# Altium schematic sheet MCU_Power_Radio.SchDoc
size B
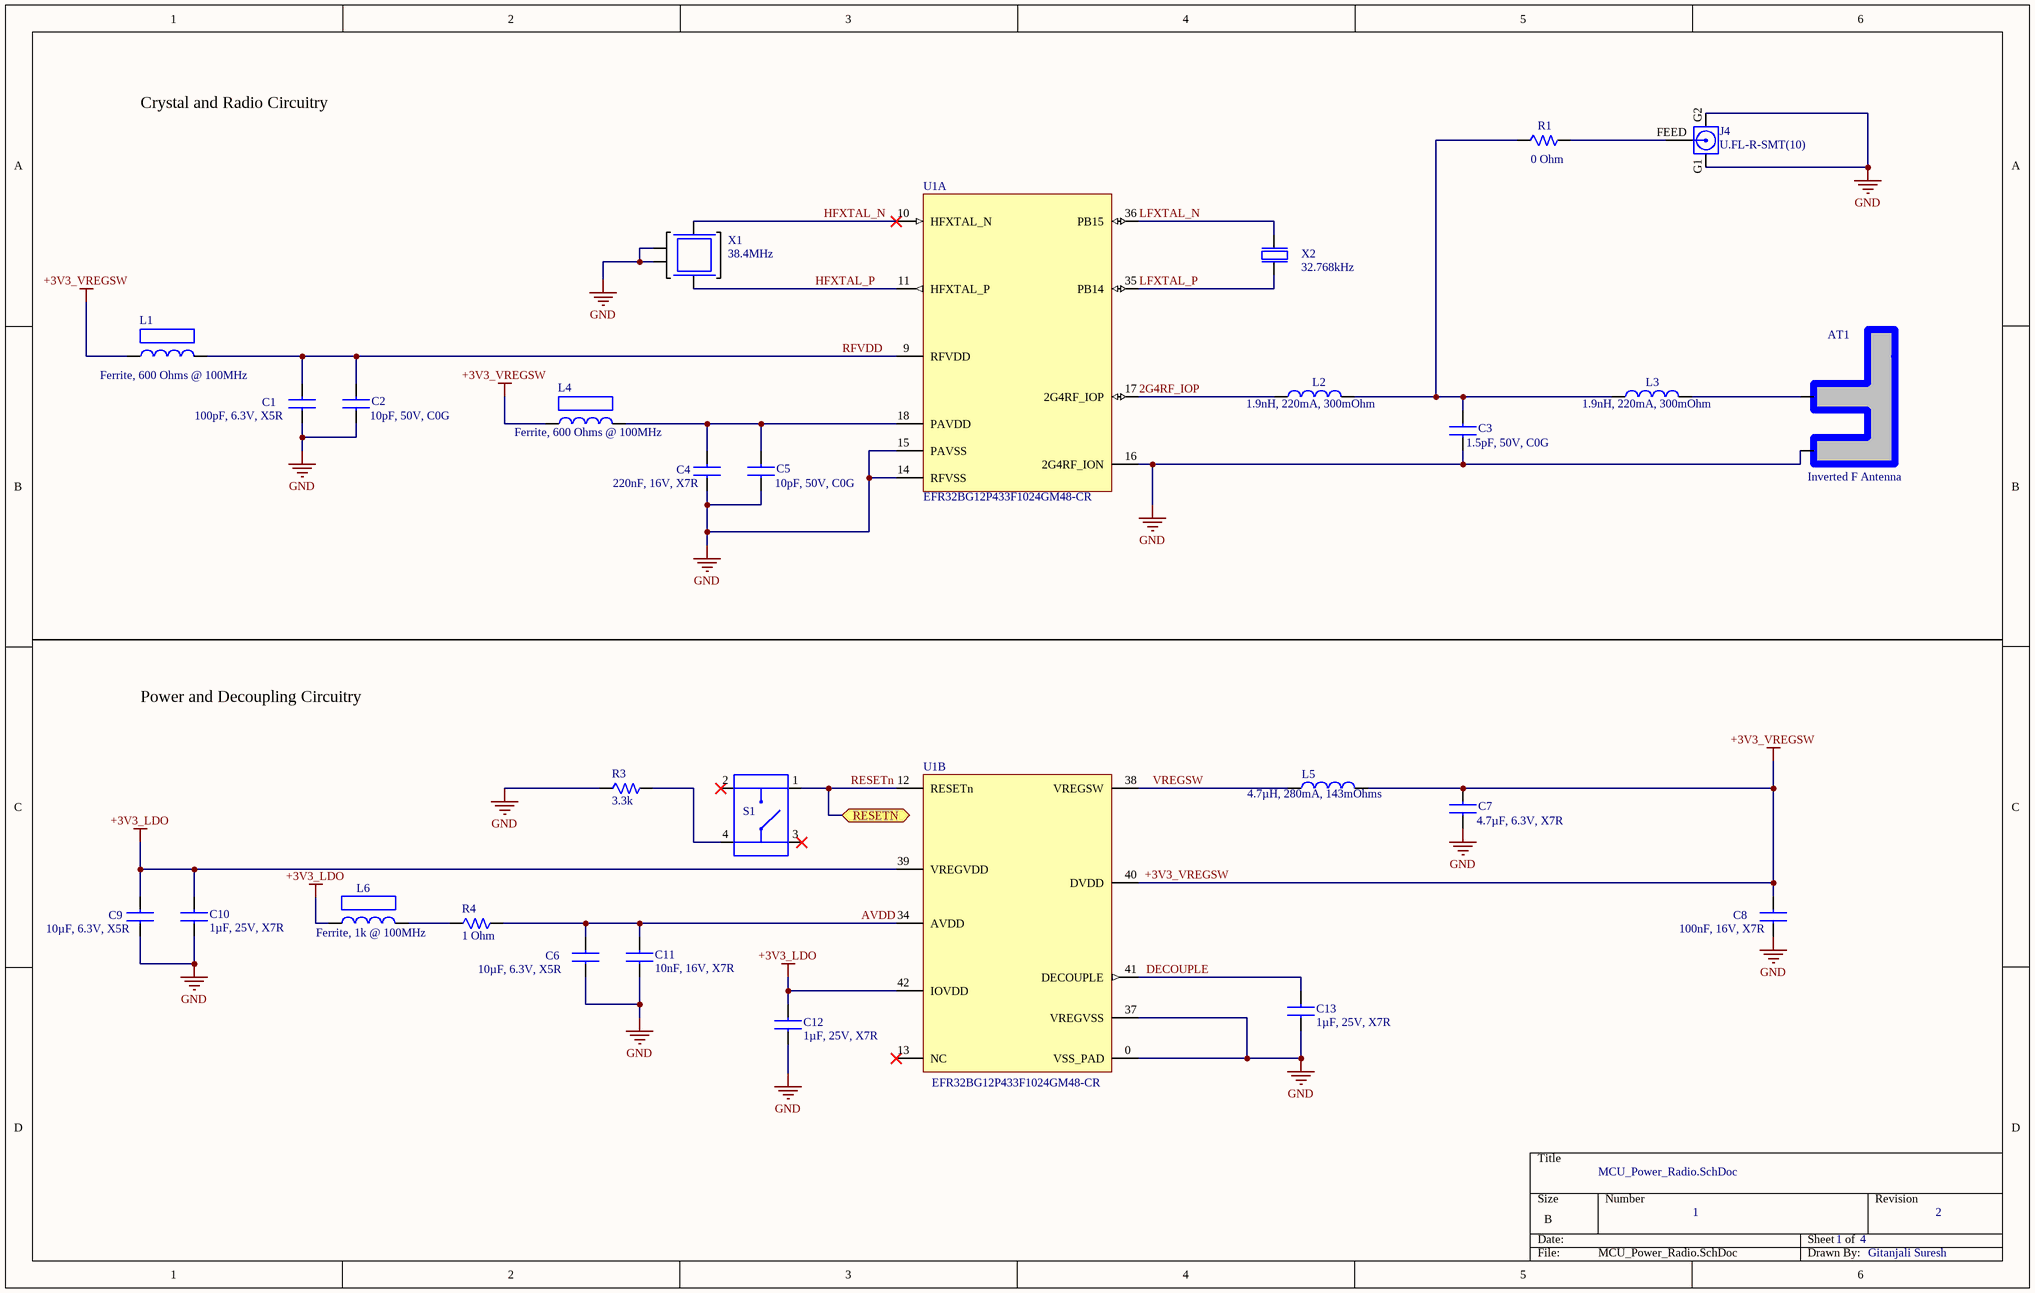
[diagram p0: MCU_Power_Radio.SchDoc]

## Parts
AT1  Inverted F Antenna  [F-Antenna]  (net tie, no BOM)
C1  100pF, 6.3V, X5R  [CAP_X7R_100PF]
C2  10pF, 50V, C0G  [CAP_0805_10PF]
C3  1.5pF, 50V, C0G  [CAP_0402_1.5pF]
C4  220nF, 16V, X7R  [CAP_X7R_100PF]
C5  10pF, 50V, C0G  [CAP_0805_10PF]
C6  10µF, 6.3V, X5R  [CAP_X5R_10UF]
C7  4.7µF, 6.3V, X7R  [CAP_X7R_4.7uF]
C8  100nF, 16V, X7R  [CAP_X7R_100NF]
C9  10µF, 6.3V, X5R  [CAP_X5R_10UF]
C10  1µF, 25V, X7R  [CAP_X7R_100PF]
C11  10nF, 16V, X7R  [CAP_X7R_100PF]
C12  1µF, 25V, X7R  [CAP_X7R_100PF]
C13  1µF, 25V, X7R  [CAP_X7R_100PF]
J4  U.FL-R-SMT(10)  [U.FL_connector]
L1  Ferrite, 600 Ohms @ 100MHz  [Ferrite_Bead_0603]
L2  1.9nH, 220mA, 300mOhm  [INDC1005X04N_1.9NH]
L3  1.9nH, 220mA, 300mOhm  [INDC1005X04N_1.9NH]
L4  Ferrite, 600 Ohms @ 100MHz  [Ferrite_Bead_0603]
L5  4.7µH, 280mA, 143mOhms  [IND_2228x1]
L6  Ferrite, 1k @ 100MHz  [Ferrite_Bead_1801x1]
R1  0 Ohm  [RES_0_0603]
R3  3.3k  [RES_0603_3.3k]
R4  1 Ohm  [RES_0603_10k]
S1  TACTILE SWITCH  [SW_PTS645SK50SMTR92LFS]  (value not drawn)
U1  EFR32BG12P433F1024GM48-CR  [QFN50P700X700X90_HS-49N]  (parts A,B of 3)
X1  38.4MHz  [OSCSC220P320X250X70-4N]
X2  32.768kHz  [XTAL320X150X90]

## Ports
RESETN (bidir)

## Nets
+3V3_LDO: C9.1 C10.2 C12.2 L6.2 U1.39(VREGVDD) U1.42(IOVDD)
+3V3_VREGSW: C7.1 C8.2 L1.1 L4.1 L5.2 U1.40(DVDD)
GND: AT1.1(GND) C1.1 C2.2 C3.2 C4.1 C5.2 C6.1 C7.2 C8.1 C9.2 C10.1 C11.1 C12.1 C13.1 J4.G1(GND1) J4.G2(GND2) R3.1 U1.0(VSS_PAD) U1.14(RFVSS) U1.15(PAVSS) U1.16(2G4RF_ION) U1.37(VREGVSS) X1.2 X1.4
2G4RF_IOP: L2.1 U1.17(2G4RF_IOP)
AVDD: C6.2 C11.2 R4.2 U1.34(AVDD)
DECOUPLE: C13.2 U1.41(DECOUPLE)
HFXTAL_N: U1.10(HFXTAL_N) X1.3
HFXTAL_P: U1.11(HFXTAL_P) X1.1
LFXTAL_N: U1.36(PB15) X2.1
LFXTAL_P: U1.35(PB14) X2.2
RESETn: S1.1 U1.12(RESETn) ; port RESETN
RFVDD: C1.2 C2.1 L1.2 U1.9(RFVDD)
VREGSW: L5.1 U1.38(VREGSW)
NetAT1_2: AT1.2(FEED) L3.2
NetC3_1: C3.1 L2.2 L3.1 R1.1
NetC4_2: C4.2 C5.1 L4.2 U1.18(PAVDD)
NetJ4_FEED: J4.FEED R1.2
NetL6_1: L6.1 R4.1
NetR3_2: R3.2 S1.4

Not connected (* = marked no-connect by the designer): S1 2* 3*; U1 13(NC)*

## Notes on the sheet
- Crystal and Radio Circuitry
- Power and Decoupling Circuitry
- 1
- 4
- 2
- Gitanjali Suresh

## Library data of the parts
AT1 = F_ANTENNA
C1 = 885012206028: 100 pF, 16 V, 0603 [1608 Metrické], ± 10%, X7R; Manufacturer: Wurth Electronics; Voltage Rating: 16V; Supplier 1: Digi-Key; Manufacturer Part Number: 885012206028; RoHS: Yes; Category: Ceramic Capacitors; Stock 1: 1513; Pricing 1: 1=0.10000, 10=0.02100, 100=0.01920, 500=0.01698 (USD); Mount: Surface Mount; Case/Package: 0603; Case Code (Imperial): 0603; Case Code (Metric): 1608; Min Operating Temperature: -55°C; Max Operating Temperature: 125°C; Tolerance: 10%; Packaging: Tape and Reel; Capacitance: 100pF; Length: 0.063inch; Width: 0.031inch; Thickness: 0.034inch; ComponentLink1URL: http://www.farnell.com/datasheets/2546812.pdf?src-supplier=Farnell; ComponentLink1Description: http://www.farnell.com/datasheets/2546812.pdf?src-supplier=Farnell; ComponentLink2URL: http://katalog.we-online.de/pbs/datasheet/885012206028.pdf?src-supplier=Digi-Key; ComponentLink2Description: http://katalog.we-online.de/pbs/datasheet/885012206028.pdf?src-supplier=Digi-Key; ComponentLink3URL: https://katalog.we-online.de/pbs/datasheet/885012206028.pdf?src-supplier=Digi-Key; ComponentLink3Description: https://katalog.we-online.de/pbs/datasheet/885012206028.pdf?src-supplier=Digi-Key; Supplier Part Number 1: 732-7947-1-ND
C2 C5 = VJ0805A100JXACW1BC: CERAMIC CAP 10PF 50V, C0G, 5%, 0805; Manufacturer: Vishay; Dielectric Material: Tantalum; Temperature Coefficient: 0ppm/°C; Supplier 1: Digi-Key; Manufacturer Part Number: VJ0805A100JXACW1BC; RoHS: Yes; Category: Ceramic Capacitors; Stock 1: 4065; Pricing 1: 1=0.20000, 10=0.14000, 50=0.07940, 100=0.06580, 500=0.04614, 1000=0.03819 (USD); Mount: Surface Mount; Case/Package: 0805; Number of Pins: 2; Case Code (Metric): 2012; Case Code (Imperial): 0805; Min Operating Temperature: -55°C; Max Operating Temperature: 125°C; Voltage Rating (DC): 50V; Tolerance: 5%; Packaging: Tape and Reel; Package Quantity: 4000; Capacitance: 10pF; Voltage Rating: 50V; Dielectric: C0G; Termination: SMD/SMT; Length: 2mm; Height: 1.45mm; Width: 0.049inch; Thickness: 0.03inch; Depth: 1.25mm; REACH SVHC: Unknown; Lead Free: Lead Free; ComponentLink1URL: https://datasheet.ciiva.com/8063/1760306-8063331.pdf?src-supplier=Element14; ComponentLink1Description: https://datasheet.ciiva.com/8063/1760306-8063331.pdf?src-supplier=Element14; ComponentLink2URL: https://datasheet.ciiva.com/176/vjw1bcbascomseries-176727.pdf?src-supplier=Digi-Key; ComponentLink2Description: https://datasheet.ciiva.com/176/vjw1bcbascomseries-176727.pdf?src-supplier=Digi-Key; ComponentLink3URL: https://datasheet.ciiva.com/11486/vjw1bcbascomseries-11486214.pdf?src-supplier=Avnet; ComponentLink3Description: https://datasheet.ciiva.com/11486/vjw1bcbascomseries-11486214.pdf?src-supplier=Avnet; ComponentLink4URL: https://datasheet.ciiva.com/16201/vjw1bcbascomseries-16201004.pdf?src-supplier=Future+Electronics; ComponentLink4Description: https://datasheet.ciiva.com/16201/vjw1bcbascomseries-16201004.pdf?src-supplier=Future+Electronics; Supplier Part Number 1: 720-1625-1-ND
C3 = GJM1555C1H1R5WB01D: Cap Ceramic 1.5pF 50V C0G 0.05pF SMD 0402 125C Paper T/R; Manufacturer: Murata; Supplier 1: Digi-Key; Manufacturer Part Number: GJM1555C1H1R5WB01D; RoHS: Yes; Category: Ceramic Capacitors; Stock 1: 83250; Pricing 1: 1=0.24000, 10=0.16200, 50=0.10800, 100=0.09180, 500=0.06480, 1000=0.05670, 2500=0.05400, 5000=0.04995 (USD); Mount: Surface Mount; Case/Package: 0402; Case Code (Imperial): 0402; Case Code (Metric): 1005; Min Operating Temperature: -55°C; Max Operating Temperature: 125°C; Packaging: Tape and Reel; Capacitance: 1.5pF; Voltage Rating: 50V; Voltage Rating (DC): 50V; Package Quantity: 10000; Dielectric: C0G; Termination: SMD/SMT; Length: 1mm; Height: 0.5mm; Width: 0.02inch; Thickness: 0.022inch; Depth: 0.5mm; Radiation Hardening: No; Lead Free: Lead Free; ComponentLink1URL: https://datasheet.ciiva.com/18183/getdatasheetpartid-312921-18183825.pdf?src-supplier=Verical; ComponentLink1Description: https://datasheet.ciiva.com/18183/getdatasheetpartid-312921-18183825.pdf?src-supplier=Verical; Supplier Part Number 1: 490-11199-1-ND
C4 = 885012206048: 220nF/0.22UF, 16V, X7R, 10%, 0603, CERAMIC CAPACITOR ; Product Range:CC Series; Capacitance:0.22 F; Capacitance Tolerance: 10%; Dielectric Characteristic:X7R; Voltage Rating:16V; Ceramic Capacitor Case:0603 ; Packaging:Cut Tape;RoHS Compliant: Yes; Manufacturer: Yageo; Manufacturer Part Number: CC0805KRX7R7BB224; Insulation Resistance: 100GR; RoHS: Yes; Category: Ceramic Capacitors; Stock 1: 3851; Pricing 1: 1=0.19000, 10=0.13300, 50=0.07560, 100=0.06260, 500=0.04392, 1000=0.03636 (USD); Mount: Surface Mount; Case/Package: 0805; Number of Pins: 2; Dielectric Material: Ceramic; Case Code (Imperial): 0805; Case Code (Metric): 2012; Material: Ceramic; Min Operating Temperature: -55°C; Max Operating Temperature: 125°C; Capacitance: 220nF; Tolerance: 10%; Dielectric: X7R; Packaging: Tape and Reel; Voltage: 16V; Voltage Rating: 16V; Termination: SMD/SMT; Length: 2mm; Height: 0.85mm; Depth: 1.25mm; Width: 0.049inch; Thickness: 0.037inch; Radiation Hardening: No; REACH SVHC: Unknown; Lead Free: Lead Free; Halogen Free: Halogen Free; ComponentLink1URL: https://datasheet.ciiva.com/8034/1489800-8034021.pdf?src-supplier=Element14; ComponentLink1Description: https://datasheet.ciiva.com/8034/1489800-8034021.pdf?src-supplier=Element14; ComponentLink2URL: https://datasheet.ciiva.com/8034/1489800-8034022.pdf?src-supplier=Element14; ComponentLink2Description: https://datasheet.ciiva.com/8034/1489800-8034022.pdf?src-supplier=Element14; ComponentLink3URL: https://datasheet.ciiva.com/15189/getdatasheetpartid-315919-15189222.pdf?src-supplier=Verical; ComponentLink3Description: https://datasheet.ciiva.com/15189/getdatasheetpartid-315919-15189222.pdf?src-supplier=Verical; ComponentLink4URL: https://datasheet.ciiva.com/16624/upy-gphc-x7r-6-3v-to-50v-8-16624663.pdf?src-supplier=Avnet+Europe; ComponentLink4Description: https://datasheet.ciiva.com/16624/upy-gphc-x7r-6-3v-to-50v-8-16624663.pdf?src-supplier=Avnet+Europe; ComponentLink5URL: https://datasheet.ciiva.com/7978/1489800-7978206.pdf?src-supplier=Element14; ComponentLink5Description: https://datasheet.ciiva.com/7978/1489800-7978206.pdf?src-supplier=Element14; Supplier 1: Digi-Key; Supplier Part Number 1: 732-7967-1-ND
C6 C9 = 885012107004: CAP CER 10UF 6.3V X5R 0805; Manufacturer: Wurth Electronics; Tolerance: 20%; Supplier 1: Digi-Key; Manufacturer Part Number: 885012107004; RoHS: Yes; Category: Ceramic Capacitors; Stock 1: 10674; Pricing 1: 1=0.19000, 10=0.17100, 100=0.15310, 500=0.13542, 1000=0.12500 (USD); Mount: Surface Mount; Case/Package: 0805; Case Code (Metric): 2012; Case Code (Imperial): 0805; Min Operating Temperature: -55°C; Max Operating Temperature: 85°C; Packaging: Tape and Reel; Capacitance: 10uF; Voltage Rating: 6.3V; Length: 0.079inch; Width: 0.049inch; Thickness: 0.053inch; ComponentLink1URL: https://katalog.we-online.de/pbs/datasheet/885012107004.pdf?src-supplier=Digi-Key; ComponentLink1Description: https://katalog.we-online.de/pbs/datasheet/885012107004.pdf?src-supplier=Digi-Key; Supplier Part Number 1: 732-7615-1-ND
C7 = CL10B475KQ8NQNC: 4.7uF, 6.3 V, 0603 [1608 Metric], 10%, X7R, CL Series Ceramic Capacitor,; Manufacturer: Samsung; Supplier 1: Digi-Key; Manufacturer Part Number: CL10B475KQ8NQNC; RoHS: Yes; Category: Ceramic Capacitors; Stock 1: 1537367; Pricing 1: 1=0.17000, 10=0.11800, 50=0.06720, 100=0.05560, 500=0.03898, 1000=0.03227 (USD); Mount: Surface Mount; Case/Package: 0603; Case Code (Metric): 1608; Case Code (Imperial): 0603; Contact Plating: Tin; Min Operating Temperature: -55°C; Max Operating Temperature: 125°C; Capacitance: 4.7uF; Tolerance: 10%; Dielectric: X7R; Package Quantity: 1; Packaging: Tape and Reel; Voltage Rating: 6.3V; Termination: Wraparound; Length: 1.6mm; Height: 0.8mm; Width: 0.031inch; Thickness: 0.035inch; Depth: 0.8mm; Lead Free: Lead Free; ComponentLink1URL: https://datasheet.ciiva.com/25733/cl10b475kq8nqnc-25733762.pdf?src-supplier=Digi-Key; ComponentLink1Description: https://datasheet.ciiva.com/25733/cl10b475kq8nqnc-25733762.pdf?src-supplier=Digi-Key; Supplier Part Number 1: 1276-2087-1-ND
C8 = C0603C104M4RACTU: CAP 100NF 16V 0603; Manufacturer: Murata; Manufacturer Part Number: LLL215R71C104MA11L; Tolerance: 20%; RoHS: Yes; Category: Ceramic Capacitors; Stock 1: 4067; Pricing 1: 1=0.35000, 10=0.24500, 50=0.17160, 100=0.14700, 500=0.11026, 1000=0.09310 (USD); Mount: Surface Mount; Case/Package: 0508; Case Code (Imperial): 0508; Case Code (Metric): 1220; Min Operating Temperature: -55°C; Max Operating Temperature: 125°C; Dielectric: X7R; Capacitance: 100nF; Voltage Rating (DC): 16V; Packaging: Tape and Reel; Voltage Rating: 16V; Package Quantity: 1; Termination: SMD/SMT; Voltage: 16V; Length: 1.25mm; Height: 0.5mm; Depth: 2mm; Width: 2mm; Thickness: 0.02inch; Radiation Hardening: No; Lead Free: Lead Free; ComponentLink1URL: https://datasheet.ciiva.com/17455/product-17455569.pdf?src-supplier=Avnet+Europe; ComponentLink1Description: https://datasheet.ciiva.com/17455/product-17455569.pdf?src-supplier=Avnet+Europe; ComponentLink2URL: https://datasheet.ciiva.com/11786/0900766b807a1cab-11786990.pdf?src-supplier=RSComponents; ComponentLink2Description: https://datasheet.ciiva.com/11786/0900766b807a1cab-11786990.pdf?src-supplier=RSComponents; ComponentLink3URL: https://datasheet.ciiva.com/139/partnumbering-e-01-139020.pdf?src-supplier=Digi-Key; ComponentLink3Description: https://datasheet.ciiva.com/139/partnumbering-e-01-139020.pdf?src-supplier=Digi-Key; ComponentLink4URL: https://datasheet.ciiva.com/139/partnumbering-e-01-139021.pdf?src-supplier=Digi-Key; ComponentLink4Description: https://datasheet.ciiva.com/139/partnumbering-e-01-139021.pdf?src-supplier=Digi-Key; ComponentLink5URL: https://datasheet.ciiva.com/139/partnumbering-e-01-139022.pdf?src-supplier=Digi-Key; ComponentLink5Description: https://datasheet.ciiva.com/139/partnumbering-e-01-139022.pdf?src-supplier=Digi-Key; Supplier 1: Digi-Key; Supplier Part Number 1: 399-1099-1-ND
C10 C12 C13 = 885012206076: CAP CER 1UF 25V X7R 0603; Manufacturer: Yageo; Manufacturer Part Number: CC1206MKX7R8BB105; Tolerance: 20%; RoHS: Yes; Category: Ceramic Capacitors; Stock 1: 18295; Pricing 1: 1=0.26000, 10=0.17700, 50=0.10640, 100=0.08980, 500=0.06146, 1000=0.05437 (USD); Mount: Surface Mount; Case/Package: 1206; Min Operating Temperature: -55°C; Max Operating Temperature: 125°C; Packaging: Tape and Reel; Capacitance: 1uF; Dielectric: X7R; Voltage Rating: 25V; Voltage Rating (DC): 25V; Length: 0.126inch; Width: 0.063inch; Thickness: 0.049inch; Depth: 1.6mm; Lead Free: Lead Free; Halogen Free: Halogen Free; ComponentLink1URL: https://datasheet.ciiva.com/13207/upy-gphc-x7r-6-3v-to-50v-8-12304-13207429.pdf?src-supplier=Mouser; ComponentLink1Description: https://datasheet.ciiva.com/13207/upy-gphc-x7r-6-3v-to-50v-8-12304-13207429.pdf?src-supplier=Mouser; Supplier 1: Digi-Key; Supplier Part Number 1: 732-7994-1-ND
C11 = 885012206040: CAP CER 10nF 16V X7R 0603; Manufacturer: Yageo; Manufacturer Part Number: CC0402MRX7R7BB103; Tolerance: 20%; RoHS: Yes; Category: Ceramic Capacitors; Stock 1: 33657; Pricing 1: 1=0.10000, 10=0.01800, 50=0.00960, 100=0.00780, 500=0.00558, 1000=0.00439, 2500=0.00399, 5000=0.00367 (USD); Mount: Surface Mount; Case/Package: 0402; Number of Pins: 2; Weight: 2.3E-05oz; Case Code (Metric): 1005; Case Code (Imperial): 0402; Min Operating Temperature: -55°C; Max Operating Temperature: 125°C; Packaging: Tape and Reel; Voltage Rating (DC): 16V; Capacitance: 10nF; Voltage Rating: 16V; Dielectric: X7R; Termination: SMD/SMT; Resistor Type: Ceramic; Length: 0.039inch; Width: 0.02inch; Thickness: 0.022inch; Depth: 0.5mm; REACH SVHC: No SVHC; Lead Free: Lead Free; Halogen Free: Halogen Free; ComponentLink1URL: https://datasheet.ciiva.com/13264/upy-gphc-x7r-6-3v-to-50v-8-12304-13264234.pdf?src-supplier=Mouser; ComponentLink1Description: https://datasheet.ciiva.com/13264/upy-gphc-x7r-6-3v-to-50v-8-12304-13264234.pdf?src-supplier=Mouser; Supplier 1: Digi-Key; Supplier Part Number 1: 732-7959-1-ND
J4 = U.FL connector U.FL-R-SMT(10): CONN UMC JACK STR 50 OHM SMD; Manufacturer: Hirose Electric Co Ltd; Connector Style: U.FL; Connector Type: Jack, Male Pin; Contact Termination: Solder; Impedance: 50 Ohm; Frequency - Max: 6GHz; Body Material: Phosphor Bronze; Body Finish: Silver; Center Contact Plating: Gold; Dielectric Material: Liquid Crystal Polymer (LCP); Gender: Plug; Brand: Hirose Connector; Maximum Frequency: 6 GHz; Supplier 1: Digi-Key; RoHS: RoHS Compliant; Category: Connectors, Interconnects; Stock 1: 132773; Pricing 1: 1=1.33, 10=1.173, 25=1.104, 50=1.058, 100=1.012, 250=0.92004, 500=0.82804, 1000=0.7216 (USD); Packaging: Cut Tape (CT); Shield Termination: Solder; Mounting Type: Surface Mount; Cable Group: -; Fastening Type: Snap-On; Features: -; Housing Color: Silver; Ingress Protection: -; Center Contact Material: Phosphor Bronze; Voltage Rating: -; Operating Temperature: -40°C ~ 90°C; ComponentLink1URL: http://media.digikey.com/pdf/Data%20Sheets/Hirose%20PDFs/UFL%20Series.pdf; ComponentLink1Description: http://media.digikey.com/pdf/Data%20Sheets/Hirose%20PDFs/UFL%20Series.pdf; Supplier 2: Mouser; Stock 2: 89108; Pricing 2: 1=1.75, 10=1.40, 100=1.34, 250=1.22, 500=1.12, 1000=0.974, 2500=0.882, 5000=0.852, 10000=0.792 (AUD); Contact Plating: Gold; Operating Temperature Range: - 40 C to + 90 C; Orientation: Vertical; Product: Connectors; Series: U.FL; Termination Style: Solder; Contact Material: Brass; Product Category: Coaxial Connectors; Standard Pack Qty: 2500; Tradename: U.FL; RoHS - Mouser: Y; Minimum Order Quantity: 1; Reeling: True; ComponentLink2URL: http://www.hirose.co.jp/cataloge_hp/ed_UFL_20141014.pdf; ComponentLink2Description: http://www.hirose.co.jp/cataloge_hp/ed_UFL_20141014.pdf; Supplier Part Number 1: H9161CT-ND; Supplier Part Number 2: 798-U.FL-R-SMT10; Manufacturer Part Number: U.FL-R-SMT(10)
L1 L4 = BLM18AG601SN1D: BLM18AG601SN1D - Ferrite Bead, 0603 / 1608, 600 ohm, 500 mA, Série BLM18A, 0.38 ohm, ± 25%; Manufacturer: Murata; Material: Steel,Ferrite; Impedance: 600R; Current Rating: 500mA; DC Resistance (DCR): 380mR; Shielding: Unshielded; Number of Circuits: 1; Supplier 1: Digi-Key; Manufacturer Part Number: BLM18AG601SN1D; RoHS: Yes; Category: Inductors; Stock 1: 294956; Pricing 1: 1=0.10000, 10=0.07200, 25=0.06560, 50=0.05900, 100=0.04320, 250=0.03144, 500=0.02882, 1000=0.02489 (USD); Case/Package: 0603; Number of Pins: 2; Weight: 7.1E-05oz; Core Material: Ferrite; Case Code (Metric): 1608; Case Code (Imperial): 0603; Min Operating Temperature: -55°C; Max Operating Temperature: 125°C; Tolerance: 25%; Package Quantity: 1; Packaging: Tape and Reel; Termination: SMD/SMT; Max DC Current: 500mA; Max Current Rating: 500mA; Number of Lines: 1; Test Frequency: 100MHz; DC Current: 500mA; Frequency: 100MHz; Length: 1.6mm; Height: 0.8mm; Width: 0.8mm; Depth: 0.8mm; Radiation Hardening: No; REACH SVHC: No SVHC; Military Standard: Not; Lead Free: Lead Free; ComponentLink1URL: https://datasheet.ciiva.com/19460/1844766-19460213.pdf?src-supplier=Jameco; ComponentLink1Description: https://datasheet.ciiva.com/19460/1844766-19460213.pdf?src-supplier=Jameco; ComponentLink2URL: https://datasheet.ciiva.com/29347/442309-da-01-en-chip-drossel-0603-600r-500ma-1-6x0-8mm-29347900.pdf?src-supplier=Conrad; ComponentLink2Description: https://datasheet.ciiva.com/29347/442309-da-01-en-chip-drossel-0603-600r-500ma-1-6x0-8mm-29347900.pdf?src-supplier=Conrad; ComponentLink3URL: https://datasheet.ciiva.com/41449/001172228-da-01-en-drossel-0603-600r-1-6x0-8mm-4000st-41449517.pdf?src-supplier=Conrad; ComponentLink3Description: https://datasheet.ciiva.com/41449/001172228-da-01-en-drossel-0603-600r-1-6x0-8mm-4000st-41449517.pdf?src-supplier=Conrad; ComponentLink4URL: https://datasheet.ciiva.com/1012/l0110s0100blm18a-1012017.pdf?src-supplier=Digi-Key; ComponentLink4Description: https://datasheet.ciiva.com/1012/l0110s0100blm18a-1012017.pdf?src-supplier=Digi-Key; ComponentLink5URL: https://datasheet.ciiva.com/1012/l0110s0100blm18a-1012018.pdf?src-supplier=Digi-Key; ComponentLink5Description: https://datasheet.ciiva.com/1012/l0110s0100blm18a-1012018.pdf?src-supplier=Digi-Key; ComponentLink6URL: https://datasheet.ciiva.com/1012/l0110s0100blm18a-1012019.pdf?src-supplier=Digi-Key; ComponentLink6Description: https://datasheet.ciiva.com/1012/l0110s0100blm18a-1012019.pdf?src-supplier=Digi-Key; ComponentLink7URL: https://datasheet.ciiva.com/1466/1756147-1466933.pdf?src-supplier=Element14; ComponentLink7Description: https://datasheet.ciiva.com/1466/1756147-1466933.pdf?src-supplier=Element14; ComponentLink8URL: https://datasheet.ciiva.com/1466/1756147-1466934.pdf?src-supplier=Element14; ComponentLink8Description: https://datasheet.ciiva.com/1466/1756147-1466934.pdf?src-supplier=Element14; ComponentLink9URL: https://datasheet.ciiva.com/16210/l0110s0100blm18a-16210006.pdf?src-supplier=Future+Electronics; ComponentLink9Description: https://datasheet.ciiva.com/16210/l0110s0100blm18a-16210006.pdf?src-supplier=Future+Electronics; ComponentLink10URL: https://datasheet.ciiva.com/3081/l0110s0100blm18a-3081613.pdf?src-supplier=Avnet; ComponentLink10Description: https://datasheet.ciiva.com/3081/l0110s0100blm18a-3081613.pdf?src-supplier=Avnet; Supplier Part Number 1: 490-1014-1-ND
L2 L3 = LQP15MN1N9W02D: Inductor 1.9nH 500MHz 13Q-Factor 220mA 300mOhm DCR 0402 Paper T/R; Manufacturer: Murata; Core Material: Ferrite; Resistance: 300mR; Self Resonant Frequency: 6GHz; Q Factor: 13; Shielding: Unshielded; Supplier 1: Digi-Key; Manufacturer Part Number: LQP15MN1N9W02D; RoHS: Yes; Category: Fixed Inductors; Stock 1: 38797; Pricing 1: 1=0.19000, 10=0.17100, 25=0.15240, 50=0.12960, 100=0.11430, 250=0.10476, 500=0.09526, 1000=0.08001, 2500=0.06858 (USD); Mount: Surface Mount; Case/Package: 0402; Case Code (Imperial): 0402; Case Code (Metric): 1005; Min Operating Temperature: -40°C; Max Operating Temperature: 85°C; Package Quantity: 10000; Packaging: Tape and Reel; Inductance: 1.9nH; Max DC Current: 220mA; DC Resistance (DCR): 300mR; Termination: SMD/SMT; Resistor Type: Thin Film; Test Frequency: 500MHz; Current Rating: 220mA; Length: 1mm; Height: 0.35mm; Width: 0.5mm; Height - Seated (Max): 0.018inch; Depth: 0.6mm; Radiation Hardening: No; REACH SVHC: No SVHC; ComponentLink1URL: https://datasheet.ciiva.com/30490/0900766b81256025-30490364.pdf?src-supplier=RSComponents; ComponentLink1Description: https://datasheet.ciiva.com/30490/0900766b81256025-30490364.pdf?src-supplier=RSComponents; ComponentLink2URL: https://datasheet.ciiva.com/8507/l0075s0084lqp15m-8507198.pdf?src-supplier=Avnet; ComponentLink2Description: https://datasheet.ciiva.com/8507/l0075s0084lqp15m-8507198.pdf?src-supplier=Avnet; Supplier Part Number 1: 490-11739-1-ND
L5 = 74479787247: 4.7uH, 1.25 A, 1008 [2520 Metric] WURTH ELEKTRONIK         74479787247             Surface Mount High Frequency Inductor, WE-PMI Series,; Manufacturer: Wurth Electronics; Core Material: Ferrite; Inductance Tolerance: 20%; Self Resonant Frequency: 40MHz; Q Factor: 20; Shielding: Shielded; Max DC Current: 1.25A; DC Resistance (DCR): 110mR; Test Frequency: 1MHz; Supplier 1: Digi-Key; Manufacturer Part Number: 74479787247; RoHS: Yes; Category: Fixed Inductors; Stock 1: 2270; Pricing 1: 1=1.10000, 10=1.07000, 50=0.96600, 100=0.93200, 500=0.86300, 1000=0.79400 (USD); Case/Package: SMD/SMT; Weight: 0.001129oz; Case Code (Metric): 2516; Case Code (Imperial): 1008; Min Operating Temperature: -40°C; Max Operating Temperature: 125°C; Packaging: Cut Tape; Inductance: 4.7uH; Termination: SMD/SMT; Package Quantity: 3000; Length: 2.5mm; Height: 1mm; Width: 2mm; REACH SVHC: Unknown; ComponentLink1URL: https://datasheet.ciiva.com/7354/1599851-7354771.pdf?src-supplier=Newark; ComponentLink1Description: https://datasheet.ciiva.com/7354/1599851-7354771.pdf?src-supplier=Newark; ComponentLink2URL: https://datasheet.ciiva.com/24213/74479787247-253805-24213913.pdf?src-supplier=Mouser; ComponentLink2Description: https://datasheet.ciiva.com/24213/74479787247-253805-24213913.pdf?src-supplier=Mouser; ComponentLink3URL: https://datasheet.ciiva.com/7754/1599851-7754726.pdf?src-supplier=Element14; ComponentLink3Description: https://datasheet.ciiva.com/7754/1599851-7754726.pdf?src-supplier=Element14; Supplier Part Number 1: 732-14079-1-ND
L6 = 74279266: Ferrite Bead, 0603 [1608 Metric], 1 kohm, 200 mA, WE-CBF Series, 0.6 ohm, ± 25%; Manufacturer: Wurth Electronics; Impedance: 1kR; Max DC Current: 200mA; DC Resistance (DCR): 600mR; Inductance: 1.8nH; Shielding: Unshielded; Supplier 1: Digi-Key; Manufacturer Part Number: 74279266; RoHS: Yes; Category: Ferrite Beads and Chips; Stock 1: 123904; Pricing 1: 1=0.17000, 50=0.16800, 100=0.15500, 500=0.14800, 1000=0.14100, 2000=0.13400 (USD); Case/Package: SMD/SMT; Case Code (Metric): 1608; Case Code (Imperial): 0603; Core Material: Ferrite; Min Operating Temperature: -55°C; Max Operating Temperature: 125°C; Tolerance: 25%; Packaging: Tape and Reel; Termination: SMD/SMT; Test Frequency: 100MHz; Current Rating: 200mA; Length: 1.6mm; Height: 0.8mm; Width: 0.8mm; Depth: 0.8mm; Lead Free: Lead Free; REACH SVHC: Unknown; ComponentLink1URL: https://datasheet.ciiva.com/14634/0900766b801ef1d0-14634816.pdf?src-supplier=Allied+Electronics; ComponentLink1Description: https://datasheet.ciiva.com/14634/0900766b801ef1d0-14634816.pdf?src-supplier=Allied+Electronics; ComponentLink2URL: https://datasheet.ciiva.com/23763/74279266-23763009.pdf?src-supplier=Newark; ComponentLink2Description: https://datasheet.ciiva.com/23763/74279266-23763009.pdf?src-supplier=Newark; ComponentLink3URL: https://datasheet.ciiva.com/11799/0900766b801ef1d0-11799352.pdf?src-supplier=RSComponents; ComponentLink3Description: https://datasheet.ciiva.com/11799/0900766b801ef1d0-11799352.pdf?src-supplier=RSComponents; ComponentLink4URL: https://datasheet.ciiva.com/14971/74279266-14971192.pdf?src-supplier=Digi-Key; ComponentLink4Description: https://datasheet.ciiva.com/14971/74279266-14971192.pdf?src-supplier=Digi-Key; ComponentLink5URL: https://datasheet.ciiva.com/12395/74279266-221135-12395453.pdf?src-supplier=Mouser; ComponentLink5Description: https://datasheet.ciiva.com/12395/74279266-221135-12395453.pdf?src-supplier=Mouser; ComponentLink6URL: https://datasheet.ciiva.com/1466/1705901-1466509.pdf?src-supplier=Element14; ComponentLink6Description: https://datasheet.ciiva.com/1466/1705901-1466509.pdf?src-supplier=Element14; ComponentLink7URL: https://datasheet.ciiva.com/22711/1705901-22711422.pdf?src-supplier=Element14; ComponentLink7Description: https://datasheet.ciiva.com/22711/1705901-22711422.pdf?src-supplier=Element14; ComponentLink8URL: https://datasheet.ciiva.com/48698/001087059-da-01-ml-we-cbf-smd-ferrit-74279266-de-en-48698427.pdf?src-supplier=Conrad; ComponentLink8Description: https://datasheet.ciiva.com/48698/001087059-da-01-ml-we-cbf-smd-ferrit-74279266-de-en-48698427.pdf?src-supplier=Conrad; Supplier Part Number 1: 732-4484-1-ND
R1 = RC0603JR-070RL: Jumper, 0 ohm, 0603 [Metrisch 1608], Baureihe RC, 75 V, Dickschicht; Manufacturer: Yageo; Resistance: 0mR; Tolerance: 1%; Power Rating: 100mW; Voltage Rating (DC): 50V; Temperature Coefficient: 200ppm/°C; Supplier 1: Digi-Key; Manufacturer Part Number: RC0603JR-070RL; RoHS: Yes; Category: Chip SMD Resistors; Stock 1: 12794789; Pricing 1: 1=0.10000, 10=0.01700, 25=0.01240, 50=0.00960, 100=0.00700, 250=0.00536, 500=0.00428, 1000=0.00315 (USD); Case/Package: 0603; Number of Pins: 2; Contact Plating: Tin,Matte; Case Code (Imperial): 0603; Case Code (Metric): 1608; Min Operating Temperature: -55°C; Max Operating Temperature: 155°C; Resistor Type: Thick Film; Packaging: Tape and Reel; Termination: SMD/SMT; Package Quantity: 5000; Voltage Rating: 50V; Length: 1.6mm; Height: 0.45mm; Width: 0.8mm; Depth: 0.8mm; Radiation Hardening: No; REACH SVHC: No SVHC; Lead Free: Lead Free; Military Standard: Not; ComponentLink1URL: https://datasheet.ciiva.com/11808/pyu-r-int-6-11808700.pdf?src-supplier=RSComponents; ComponentLink1Description: https://datasheet.ciiva.com/11808/pyu-r-int-6-11808700.pdf?src-supplier=RSComponents; ComponentLink2URL: https://datasheet.ciiva.com/7746/1738695-7746421.pdf?src-supplier=Element14; ComponentLink2Description: https://datasheet.ciiva.com/7746/1738695-7746421.pdf?src-supplier=Element14; ComponentLink3URL: https://datasheet.ciiva.com/8883/pyu-rc0603-51-rohs-l-4-8883045.pdf?src-supplier=Avnet; ComponentLink3Description: https://datasheet.ciiva.com/8883/pyu-rc0603-51-rohs-l-4-8883045.pdf?src-supplier=Avnet; ComponentLink4URL: https://datasheet.ciiva.com/15189/getdatasheetpartid-329462-15189845.pdf?src-supplier=Verical; ComponentLink4Description: https://datasheet.ciiva.com/15189/getdatasheetpartid-329462-15189845.pdf?src-supplier=Verical; ComponentLink5URL: https://datasheet.ciiva.com/7746/1738695-7746422.pdf?src-supplier=Element14; ComponentLink5Description: https://datasheet.ciiva.com/7746/1738695-7746422.pdf?src-supplier=Element14; ComponentLink6URL: https://datasheet.ciiva.com/12555/rc0603-272842-12555254.pdf?src-supplier=Mouser; ComponentLink6Description: https://datasheet.ciiva.com/12555/rc0603-272842-12555254.pdf?src-supplier=Mouser; ComponentLink7URL: https://datasheet.ciiva.com/22747/443971-22747530.pdf?src-supplier=Element14; ComponentLink7Description: https://datasheet.ciiva.com/22747/443971-22747530.pdf?src-supplier=Element14; Supplier Part Number 1: 311-0.0GRCT-ND
R3 = SDR03EZPF3301: RES SMD 3.3 KOHM 1% 0.3W 0603; Manufacturer: Yageo; Manufacturer Part Number: RC0201FR-07100RL; Resistance: 100R; Temperature Coefficient: 200ppm/°C; Power Rating: 50mW; Voltage Rating: 25V; RoHS: Yes; Category: Chip SMD Resistors; Stock 1: 274418; Pricing 1: 1=0.10000, 10=0.03700, 100=0.01500, 1000=0.00673, 2500=0.00584, 5000=0.00483 (USD); Case/Package: 0201; Contact Plating: Tin,Matte; Case Code (Metric): 0603; Case Code (Imperial): 0201; Min Operating Temperature: -55°C; Max Operating Temperature: 125°C; Tolerance: 1%; Resistor Type: Thick Film; Packaging: Tape and Reel; Package Quantity: 1; Max Power Dissipation: 50mW; Number of Terminations: 2; Termination: SMD/SMT; Features: Moisture Resistant; Length: 0.024inch; Height: 0.01inch; Width: 0.012inch; Radiation Hardening: No; REACH SVHC: Unknown; Lead Free: Lead Free; ComponentLink1URL: https://datasheet.ciiva.com/2560/pyu-r-int-thick-7-2560866.pdf?src-supplier=Digi-Key; ComponentLink1Description: https://datasheet.ciiva.com/2560/pyu-r-int-thick-7-2560866.pdf?src-supplier=Digi-Key; ComponentLink2URL: https://datasheet.ciiva.com/28395/pyu-rc0201-51-rohs-l-8-28395391.pdf?src-supplier=Avnet+Europe; ComponentLink2Description: https://datasheet.ciiva.com/28395/pyu-rc0201-51-rohs-l-8-28395391.pdf?src-supplier=Avnet+Europe; ComponentLink3URL: https://datasheet.ciiva.com/2560/pyu-r-int-thick-7-2560865.pdf?src-supplier=Digi-Key; ComponentLink3Description: https://datasheet.ciiva.com/2560/pyu-r-int-thick-7-2560865.pdf?src-supplier=Digi-Key; ComponentLink4URL: https://datasheet.ciiva.com/2560/pyu-r-int-thick-7-2560867.pdf?src-supplier=Digi-Key; ComponentLink4Description: https://datasheet.ciiva.com/2560/pyu-r-int-thick-7-2560867.pdf?src-supplier=Digi-Key; ComponentLink5URL: https://datasheet.ciiva.com/16855/pyu-rc0201-51-rohs-l-8-16855781.pdf?src-supplier=Avnet+Europe; ComponentLink5Description: https://datasheet.ciiva.com/16855/pyu-rc0201-51-rohs-l-8-16855781.pdf?src-supplier=Avnet+Europe; ComponentLink6URL: https://datasheet.ciiva.com/8887/pyu-rc0201-51-rohs-l-8-8887865.pdf?src-supplier=Avnet; ComponentLink6Description: https://datasheet.ciiva.com/8887/pyu-rc0201-51-rohs-l-8-8887865.pdf?src-supplier=Avnet; Supplier 1: Digi-Key; Supplier Part Number 1: 511-1715-1-ND
R4 = KTR03EZPF1R00: RES SMD 1 OHM 1% 1/10W 0603; Manufacturer: Vishay; Manufacturer Part Number: CRCW04021R00FNED; Resistance: 1R; Power Rating: 63mW; Voltage Rating: 50V; Temperature Coefficient: 200ppm/°C; RoHS: Yes; Category: Chip SMD Resistors; Stock 1: 17185; Pricing 1: 1=0.10000, 10=0.05000, 100=0.02040, 1000=0.00914, 2500=0.00794, 5000=0.00656 (USD); Mount: Surface Mount; Case/Package: 0402; Number of Pins: 2; Weight: 2.3E-05oz; Case Code (Metric): 1005; Case Code (Imperial): 0402; Contact Plating: Tin; Min Operating Temperature: -55°C; Max Operating Temperature: 155°C; Tolerance: 1%; Packaging: Tape and Reel; Package Quantity: 10000; Resistor Type: Thick Film; Number of Terminations: 2; Termination: SMD/SMT; Max Power Dissipation: 63mW; Voltage Rating (DC): 50V; Features: Automotive AEC-Q200; Length: 1mm; Height: 0.016inch; Width: 0.02inch; Depth: 0.5mm; Radiation Hardening: No; REACH SVHC: Unknown; Military Standard: Not; Lead Free: Lead Free; ComponentLink1URL: https://datasheet.ciiva.com/6027/1697337-6027861.pdf?src-supplier=Farnell; ComponentLink1Description: https://datasheet.ciiva.com/6027/1697337-6027861.pdf?src-supplier=Farnell; ComponentLink2URL: https://datasheet.ciiva.com/2560/dcrcwe3-2560102.pdf?src-supplier=Digi-Key; ComponentLink2Description: https://datasheet.ciiva.com/2560/dcrcwe3-2560102.pdf?src-supplier=Digi-Key; ComponentLink3URL: https://datasheet.ciiva.com/3256/dcrcwe3-3256200.pdf?src-supplier=Avnet; ComponentLink3Description: https://datasheet.ciiva.com/3256/dcrcwe3-3256200.pdf?src-supplier=Avnet; ComponentLink4URL: https://datasheet.ciiva.com/5552/dcrcwe3-109170-5552232.pdf?src-supplier=Mouser; ComponentLink4Description: https://datasheet.ciiva.com/5552/dcrcwe3-109170-5552232.pdf?src-supplier=Mouser; ComponentLink5URL: https://datasheet.ciiva.com/16436/dcrcwe3-16436173.pdf?src-supplier=Future+Electronics; ComponentLink5Description: https://datasheet.ciiva.com/16436/dcrcwe3-16436173.pdf?src-supplier=Future+Electronics; ComponentLink6URL: https://datasheet.ciiva.com/7841/125364-7841807.pdf?src-supplier=Element14; ComponentLink6Description: https://datasheet.ciiva.com/7841/125364-7841807.pdf?src-supplier=Element14; ComponentLink7URL: https://datasheet.ciiva.com/2560/dcrcwe3-2560101.pdf?src-supplier=Digi-Key; ComponentLink7Description: https://datasheet.ciiva.com/2560/dcrcwe3-2560101.pdf?src-supplier=Digi-Key; ComponentLink8URL: https://datasheet.ciiva.com/2560/dcrcwe3-2560103.pdf?src-supplier=Digi-Key; ComponentLink8Description: https://datasheet.ciiva.com/2560/dcrcwe3-2560103.pdf?src-supplier=Digi-Key; ComponentLink9URL: https://datasheet.ciiva.com/3256/dcrcwe3-3256199.pdf?src-supplier=Avnet; ComponentLink9Description: https://datasheet.ciiva.com/3256/dcrcwe3-3256199.pdf?src-supplier=Avnet; Supplier 1: Digi-Key; Supplier Part Number 1: RHM1.00AYCT-ND
S1 = PTS645SL50SMTR92LFS: TACTILE SWITCH, SPST, 0.05A, 12VDC; Manufacturer: ITT C&K; Mechanical Life: 100000Cycles; Actuator Material: Nylon,Polyamide; Max Voltage Rating (DC): 12V; Operating Force: 1.27N; Actuator Type: Standard; Current Rating: 50mA; Switch Function: Off-Mom; Illumination Type: Non-Illuminated; Supplier 1: Digi-Key; Manufacturer Part Number: PTS645SL50SMTR92LFS; RoHS: Yes; Category: Tactile Switches; Stock 1: 59621; Pricing 1: 1=0.25000, 10=0.24200, 25=0.22960, 100=0.20780, 250=0.18944, 500=0.17610 (USD); Mount: Surface Mount; Contact Plating: Silver; Contact Material: Bronze; Color: Black; Min Operating Temperature: -20°C; Max Operating Temperature: 60°C; Packaging: Tape and Reel; Throw Configuration: SPST; Termination: Gull Wing; Voltage Rating (DC): 12V; Package Quantity: 1; Max Current Rating: 50mA; Orientation: Straight; Length: 6mm; Depth: 9mm; REACH SVHC: No SVHC; Lead Free: Lead Free; ComponentLink1URL: https://datasheet.ciiva.com/26927/getdatasheetpartid-760859-26927133.pdf?src-supplier=Verical; ComponentLink1Description: https://datasheet.ciiva.com/26927/getdatasheetpartid-760859-26927133.pdf?src-supplier=Verical; ComponentLink2URL: https://datasheet.ciiva.com/14920/pts645-14920742.pdf?src-supplier=Digi-Key; ComponentLink2Description: https://datasheet.ciiva.com/14920/pts645-14920742.pdf?src-supplier=Digi-Key; ComponentLink3URL: https://datasheet.ciiva.com/14920/pts645-14920743.pdf?src-supplier=Digi-Key; ComponentLink3Description: https://datasheet.ciiva.com/14920/pts645-14920743.pdf?src-supplier=Digi-Key; ComponentLink4URL: https://datasheet.ciiva.com/14920/pts645-14920744.pdf?src-supplier=Digi-Key; ComponentLink4Description: https://datasheet.ciiva.com/14920/pts645-14920744.pdf?src-supplier=Digi-Key; ComponentLink5URL: https://datasheet.ciiva.com/46429/1839862-46429337.pdf?src-supplier=Element14; ComponentLink5Description: https://datasheet.ciiva.com/46429/1839862-46429337.pdf?src-supplier=Element14; ComponentLink6URL: https://datasheet.ciiva.com/46429/1839862-46429338.pdf?src-supplier=Element14; ComponentLink6Description: https://datasheet.ciiva.com/46429/1839862-46429338.pdf?src-supplier=Element14; Supplier Part Number 1: CKN9088CT-ND
U1 = EFR32BG12P433F1024GM48-CR: Blue Gecko EFR32BG13; Manufacturer: Silicon Labs; Supplier 1: Digi-Key; Manufacturer Part Number: EFR32BG12P433F1024GM48-CR; RoHS: No; Stock 1: 4670; Pricing 1: 1=11.65000, 25=9.59720, 100=8.68300, 1000=6.39800 (USD); Supplier Part Number 1: 336-6197-1-ND
X1 = Q 38,40-JXS21-10-10/15-T1-FU-WA-LF: ±10ppm Crystal 10pF 4-SMD, No Lead; Manufacturer: Jauch; Supplier 1: Digi-Key; Manufacturer Part Number: Q 38,40-JXS21-10-10/15-T1-FU-WA-LF; RoHS: No; Stock 1: 4266; Pricing 1: 1=0.76000, 10=0.67600, 50=0.63220, 100=0.55860, 500=0.52920 (USD); Supplier Part Number 1: 1908-1209-1-ND
X2 = ABS07AIG-32.768KHZ-D-T: Crystals 32.768kHz AECQ200 12.5pF -40C +85C; Manufacturer: Abracon; ESR (Equivalent Series Resistance): 70kR; Frequency Tolerance: 20ppm; Supplier 1: Digi-Key; Manufacturer Part Number: ABS07AIG-32.768KHZ-D-T; RoHS: Yes; Category: Crystals; Stock 1: 7575; Pricing 1: 1=1.05000, 10=0.92700, 50=0.86680, 100=0.76610, 500=0.72576, 1000=0.60480 (USD); Mount: Surface Mount; Case/Package: SMD/SMT; Min Operating Temperature: -40°C; Max Operating Temperature: 85°C; Packaging: Tape and Reel; Frequency: 32.768kHz; Load Capacitance: 12.5pF; Length: 0.126inch; Height: 0.035inch; Width: 0.059inch; Ratings: AEC-Q200; ComponentLink1URL: http://www.mouser.com/ds/2/3/ABS07AIG-783567.pdf?src-supplier=Mouser; ComponentLink1Description: http://www.mouser.com/ds/2/3/ABS07AIG-783567.pdf?src-supplier=Mouser; ComponentLink2URL: http://www.abracon.com/AIGcrystals/ABS07AIG.pdf?src-supplier=Digi-Key; ComponentLink2Description: http://www.abracon.com/AIGcrystals/ABS07AIG.pdf?src-supplier=Digi-Key; ComponentLink3URL: https://abracon.com/Support/flyer/AutoGrade-AIG-Crystals.pdf?src-supplier=Digi-Key; ComponentLink3Description: https://abracon.com/Support/flyer/AutoGrade-AIG-Crystals.pdf?src-supplier=Digi-Key; Supplier Part Number 1: 535-13356-1-ND